# Altium schematic sheet display.SchDoc
size A4
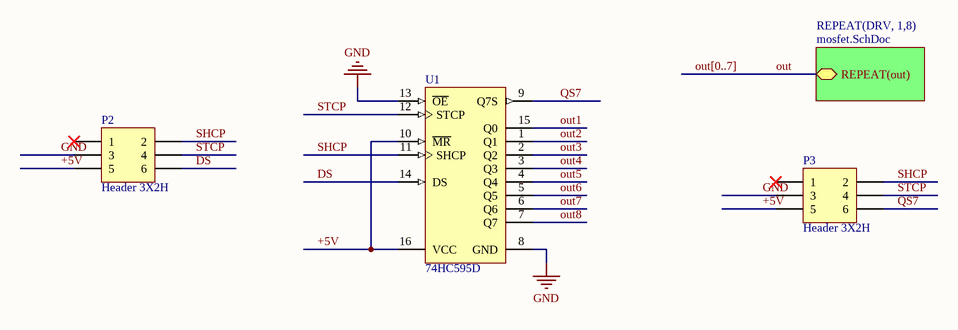
[diagram p0: display.SchDoc]

## Parts
P2  Header 3X2H  [HDR2X3H]
P3  Header 3X2H  [HDR2X3H]
U1  74HC595D  [NXP-SOT109-1_V]

## Sub-sheets
REPEAT(DRV, 1,8) = mosfet.SchDoc: REPEAT(out)

## Nets
GND: P2.3 P3.3 U1.8(GND) U1.13(~{OE})
+5V: P2.5 P3.5 U1.10(~{MR}) U1.16(VCC)
DS: P2.6 U1.14(DS)
out: sheet REPEAT(DRV, 1,8)/REPEAT(out)
out1: U1.15(Q0)
out2: U1.1(Q1)
out3: U1.2(Q2)
out4: U1.3(Q3)
out5: U1.4(Q4)
out6: U1.5(Q5)
out7: U1.6(Q6)
out8: U1.7(Q7)
QS7: P3.6 U1.9(Q7S)
SHCP: P2.2 P3.2 U1.11(SHCP)
STCP: P2.4 P3.4 U1.12(STCP)

Not connected (* = marked no-connect by the designer): P2 1*; P3 1*

## Buses and harness runs
bus out[0..7]

## Library data of the parts
P2 P3 = Header 3X2H: Header, 3-Pin, Dual row, Right Angle; LatestRevisionDate: 17-Jul-2002; LatestRevisionNote: Re-released for DXP Platform.; Publisher: Altium Limited
U1 = CMP-2000-04920-1: 8-Bit Serial-In, Serial or Parallel-Out Shift Register with Output Latches, 3-State, 2 to 6 V, -40 to 125 degC, 16-Pin SOP, RoHS, Tube; Manufacturer: NXP Semiconductors; Logic Case Style: SOIC; Shift Register Function: SerialtoParallel,SerialtoSerial; No. of Elements: 1Element; Supply Voltage Min: 2V; SVHC: NoSVHC(17-Dec-2014); Supply Voltage Max: 6V; IC Output Type: TriState; No. of Pins: 16Pins; Operating Temperature Min: -40degC; Operating Temperature Max: 125degC; MSL: MSL1-Unlimited; Datasheet URL: http://datasheet.octopart.com/74HC595D%2C112-Philips-datasheet-11979826.pdf; Package Reference: SOT109-1; Manufacturer URL: http://www.nxp.com/; Package URL: http://www.nxp.com/documents/outline_drawing/SOT109-1.pdf; Datasheet Version: Rev. 6, 12/2011; Packaging: Each; Package Description: 16-Pin Small Outline Integrated Circuit, Body 9.9 x 3.9 mm, Pitch 1.27 mm; Logic Type: ShiftRegister